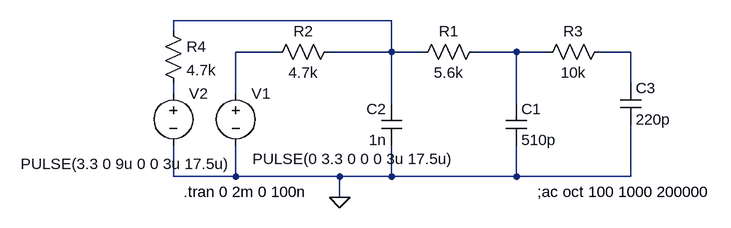
[diagram p0: schematic filter5.asc]
filter5.asc, the LTspice schematic file:
Version 4
SHEET 1 880 680
WIRE 48 16 -288 16
WIRE -288 32 -288 16
WIRE -128 64 -192 64
WIRE 48 64 48 16
WIRE 48 64 -48 64
WIRE 96 64 48 64
WIRE 240 64 176 64
WIRE 288 64 240 64
WIRE 416 64 368 64
WIRE 416 112 416 64
WIRE -288 128 -288 112
WIRE -192 128 -192 64
WIRE 48 144 48 64
WIRE 240 144 240 64
WIRE -288 256 -288 208
WIRE -192 256 -192 208
WIRE -192 256 -288 256
WIRE -32 256 -192 256
WIRE 48 256 48 208
WIRE 48 256 -32 256
WIRE 240 256 240 208
WIRE 240 256 48 256
WIRE 416 256 416 176
WIRE 416 256 240 256
WIRE -32 288 -32 256
FLAG -32 288 0
SYMBOL res 192 48 R90
WINDOW 0 0 56 VBottom 2
WINDOW 3 32 56 VTop 2
SYMATTR InstName R1
SYMATTR Value 5.6k
SYMBOL res -32 48 R90
WINDOW 0 0 56 VBottom 2
WINDOW 3 32 56 VTop 2
SYMATTR InstName R2
SYMATTR Value 4.7k
SYMBOL cap 224 144 R0
SYMATTR InstName C1
SYMATTR Value 510p
SYMBOL cap 64 208 R180
WINDOW 0 24 56 Left 2
WINDOW 3 24 8 Left 2
SYMATTR InstName C2
SYMATTR Value 1n
SYMBOL res 384 48 R90
WINDOW 0 0 56 VBottom 2
WINDOW 3 32 56 VTop 2
SYMATTR InstName R3
SYMATTR Value 10k
SYMBOL cap 400 112 R0
SYMATTR InstName C3
SYMATTR Value 220p
SYMBOL voltage -192 112 R0
WINDOW 3 26 117 Left 2
WINDOW 123 0 0 Left 2
WINDOW 39 0 0 Left 2
SYMATTR InstName V1
SYMATTR Value PULSE(0 3.3 0 0 0 3u 17.5u)
SYMBOL voltage -288 112 R0
WINDOW 3 -235 125 Left 2
WINDOW 123 0 0 Left 2
WINDOW 39 0 0 Left 2
SYMATTR InstName V2
SYMATTR Value PULSE(3.3 0 9u 0 0 3u 17.5u)
SYMBOL res -304 16 R0
SYMATTR InstName R4
SYMATTR Value 4.7k
TEXT 272 280 Left 2 !;ac oct 100 1000 200000
TEXT -272 280 Left 2 !.tran 0 2m 0 100n

The netlist it stands for:
* filter5.asc
R1 N003 N001 5.6k
R2 N001 N002 4.7k
C1 N003 0 510p
C2 0 N001 1n
R3 N004 N003 10k
C3 N004 0 220p
V1 N002 0 PULSE(0 3.3 0 0 0 3u 17.5u)
V2 N005 0 PULSE(3.3 0 9u 0 0 3u 17.5u)
R4 N001 N005 4.7k
;ac oct 100 1000 200000
.tran 0 2m 0 100n
.backanno
.end